# Altium schematic sheet TSE_mother_board_CPU_commutation.SchDoc
size 594 x 420 mm; SheetNumber: 1; SheetTotal: 3
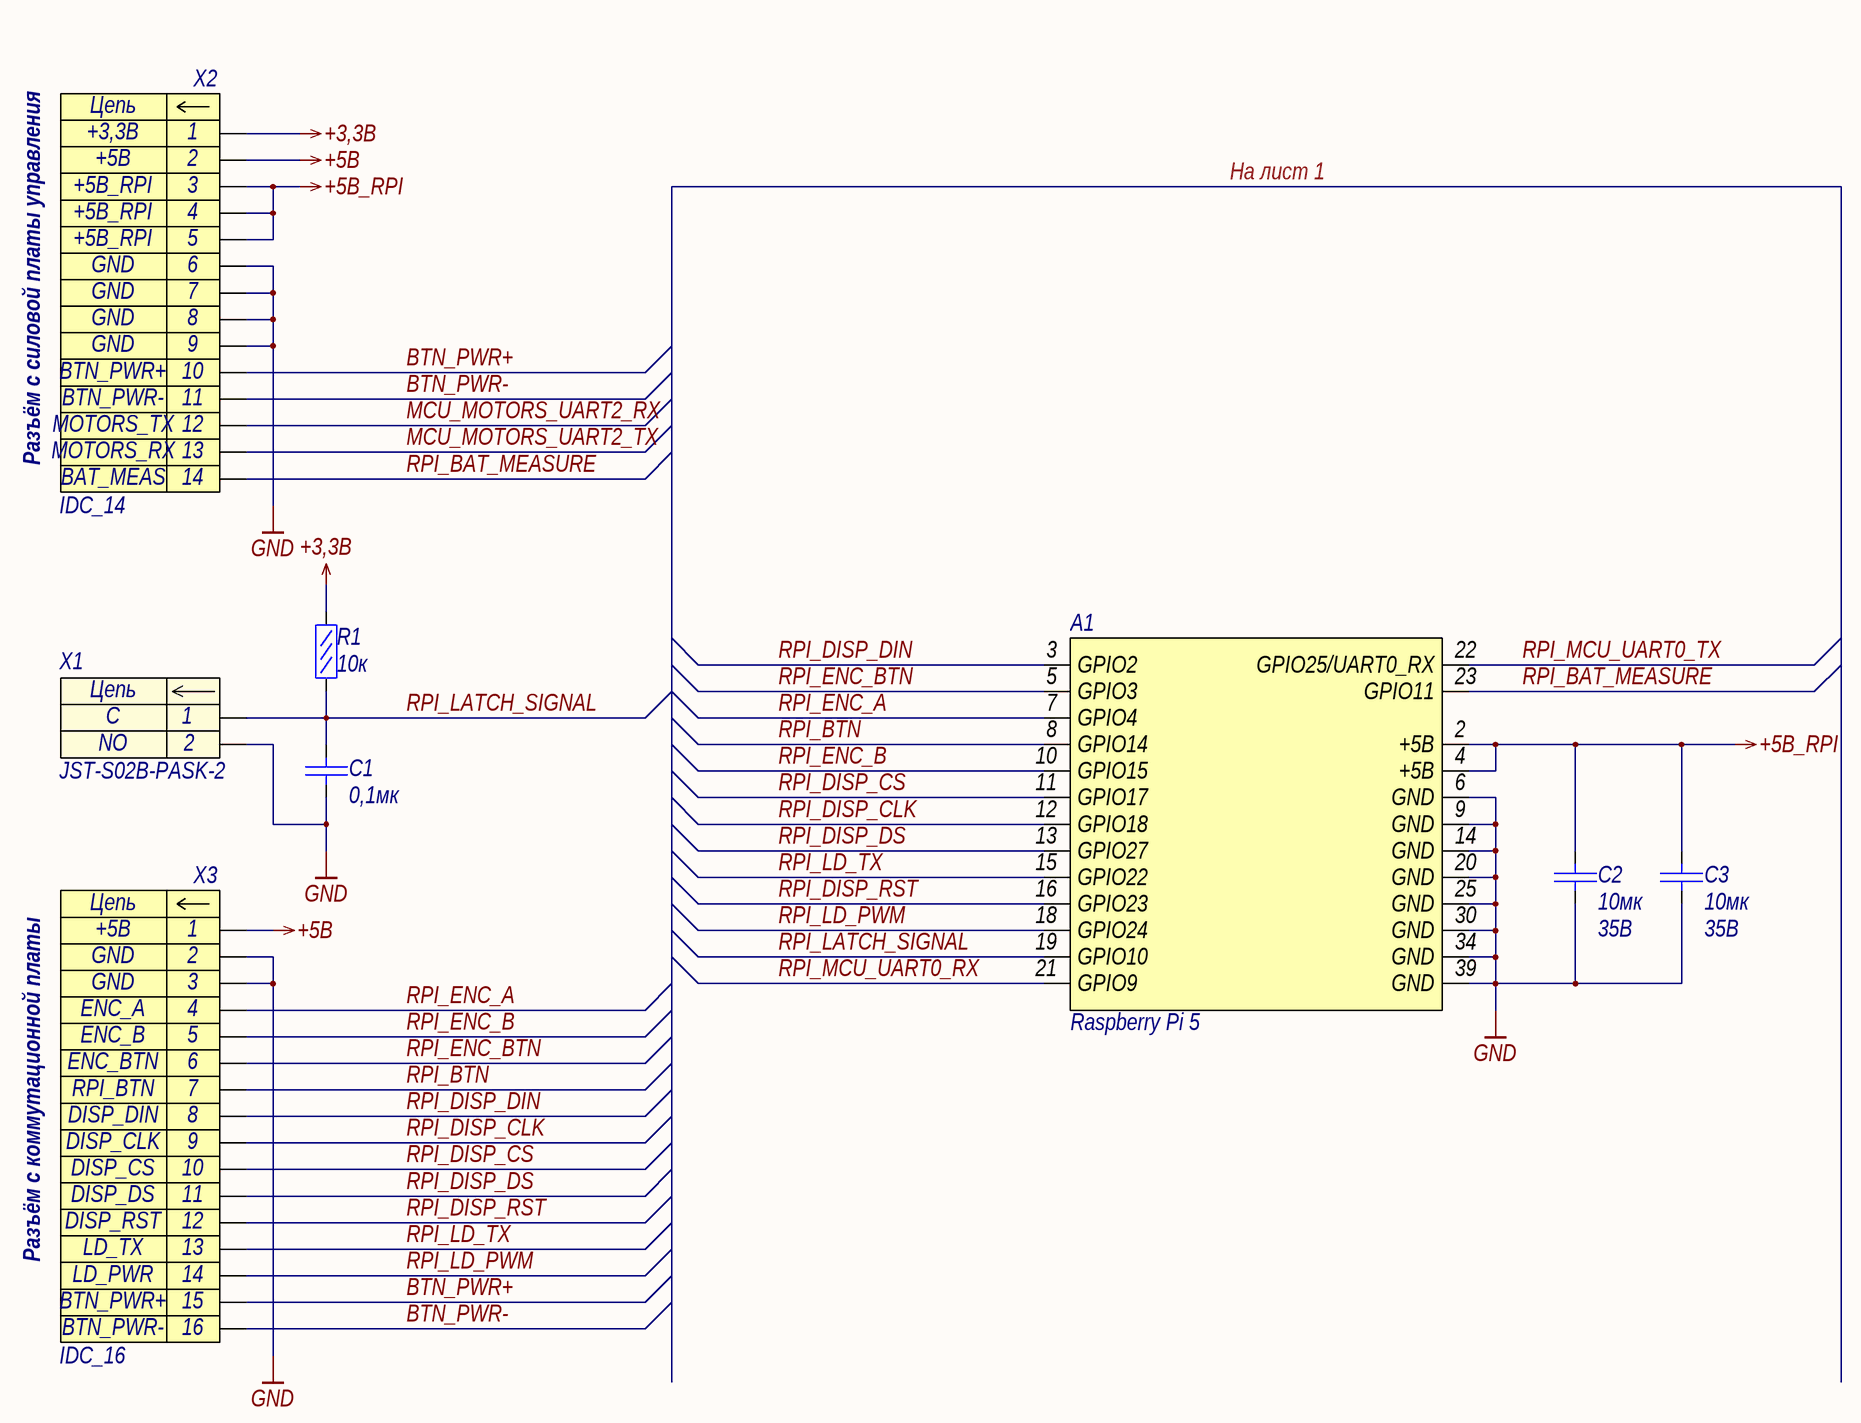
[diagram p0: TSE_mother_board_CPU_commutation.SchDoc]

## Parts
A1  Raspberry Pi 5  [PLS_40]
C1  0,1мк  [C0603]
C2  Voltage: 35В  [C1210]  (hidden comment: 10мк)
C3  Voltage: 35В  [C1210]  (hidden comment: 10мк)
R1  10к  [R0603]
X1  JST-S02B-PASK-2  [JST-S02B-PASK-2]
X2  IDC_14  [IDC1.27_14]
X3  IDC_16  [IDC1.27_16]

## Nets
+3,3В: R1.2 X2.1
+5В: X2.2 X3.1
+5В_RPI: A1.2(+5В) A1.4(+5В) C2.2 C3.2 X2.3 X2.4 X2.5
GND: A1.6(GND) A1.9(GND) A1.14(GND) A1.20(GND) A1.25(GND) A1.30(GND) A1.34(GND) A1.39(GND) C1.1 C2.1 C3.1 X1.2 X2.6 X2.7 X2.8 X2.9 X3.2 X3.3
BTN_PWR+: X2.10 X3.15
BTN_PWR-: X2.11 X3.16
MCU_MOTORS_UART2_RX: X2.12
MCU_MOTORS_UART2_TX: X2.13
RPI_BAT_MEASURE: A1.23(GPIO11) X2.14
RPI_BTN: A1.8(GPIO14) X3.7
RPI_DISP_CLK: A1.12(GPIO18) X3.9
RPI_DISP_CS: A1.11(GPIO17) X3.10
RPI_DISP_DIN: A1.3(GPIO2) X3.8
RPI_DISP_DS: A1.13(GPIO27) X3.11
RPI_DISP_RST: A1.16(GPIO23) X3.12
RPI_ENC_A: A1.7(GPIO4) X3.4
RPI_ENC_B: A1.10(GPIO15) X3.5
RPI_ENC_BTN: A1.5(GPIO3) X3.6
RPI_LATCH_SIGNAL: A1.19(GPIO10) C1.2 R1.1 X1.1
RPI_LD_PWM: A1.18(GPIO24) X3.14
RPI_LD_TX: A1.15(GPIO22) X3.13
RPI_MCU_UART0_RX: A1.21(GPIO9)
RPI_MCU_UART0_TX: A1.22(GPIO25/UART0_RX)

## Notes on the sheet
- На лист 1
- Разъём с силовой платы управления
- Разъём с коммутационной платы
- Перв. примен.
- Справ. №
- Подп. и дата
- Инв. № дубл.
- Взам. инв. №
- Изм.
- Лист
- № докум.
- Подп.
- Дата
- Лит.
- Масса
- Масштаб
- Т.контр.
- Пров.
- Разраб.
- Листов
- Инв. № подл.
- Н.контр.
- Файл:
- Утв.
- Копировал
- Формат
- (in symbol IDC_14) Цепь
- (in symbol IDC_16) Цепь
- (in symbol JST-S02B-PASK-2) Цепь

## Library data of the parts
A1 = Raspberry Pi 5: Микрокомпьютер; Наименование: Raspberry Pi 5
C1 = CC0603JPX7R9BB104: Конденсатор кер. 0,1мкФ 50В; Manufacturer: Yageo; TKE: X7R; Name: CC0603JPX7R9BB104; Value: 0,1мк
C2 C3 = CL32A106KATLNNE: Конденсатор кер. 10мкФ 35В; Manufacturer: Yageo; Name: CC1206KKX7R8BB106; TKE: X7R; Value: 10мк
R1 = RC0603FR-0710KL: Резистор 10кОм 0,063Вт 1%; Manufacturer: YAGEO; Name: RC0603FR-0710KL; Tolerance: 1%; Value: 10к
X1 = JST-S02B-PASK-2: Разъем - 2 конт. угловая вилка на плату, шаг 2,00 мм; Contact_1: C; Contact_2: NO; Наименование: JST-S02B-PASK-2
X2 = IDC_14: Разъем - 14 конт. прямая вилка на плату; Contact_1: +3,3В; Contact_2: +5В; Contact_3: +5В_RPI; Contact_6: GND; Contact_10: BTN_PWR+; Contact_11: BTN_PWR-; Contact_12: MOTORS_TX; Contact_13: MOTORS_RX; Contact_14: BAT_MEAS; Наименование: IDC_14; Contact_4: +5В_RPI; Contact_5: +5В_RPI; Contact_7: GND; Contact_8: GND; Contact_9: GND
X3 = IDC_16: Разъем - 16 конт. прямая вилка на плату; Contact_1: +5В; Contact_2: GND; Contact_4: ENC_A; Contact_5: ENC_B; Contact_6: ENC_BTN; Contact_7: RPI_BTN; Contact_8: DISP_DIN; Contact_9: DISP_CLK; Contact_10: DISP_CS; Contact_11: DISP_DS; Contact_12: DISP_RST; Contact_13: LD_TX; Contact_14: LD_PWR; Contact_15: BTN_PWR+; Contact_16: BTN_PWR-; Наименование: IDC_16; Contact_3: GND